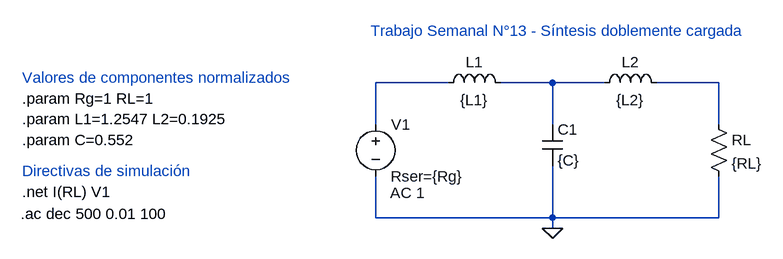
[diagram p0: schematic TS13.asc]
TS13.asc, the LTspice schematic file:
Version 4
SHEET 1 880 680
WIRE 144 144 32 144
WIRE 304 144 224 144
WIRE 384 144 304 144
WIRE 560 144 464 144
WIRE 32 208 32 144
WIRE 304 208 304 144
WIRE 560 208 560 144
WIRE 32 352 32 288
WIRE 304 352 304 272
WIRE 304 352 32 352
WIRE 560 352 560 288
WIRE 560 352 304 352
WIRE 304 368 304 352
FLAG 304 368 0
SYMBOL res 544 192 R0
SYMATTR InstName RL
SYMATTR Value {RL}
SYMBOL cap 288 208 R0
SYMATTR InstName C1
SYMATTR Value {C}
SYMBOL ind 128 160 R270
WINDOW 0 32 56 VTop 2
WINDOW 3 5 56 VBottom 2
SYMATTR InstName L1
SYMATTR Value {L1}
SYMBOL ind 368 160 R270
WINDOW 0 32 56 VTop 2
WINDOW 3 5 56 VBottom 2
SYMATTR InstName L2
SYMATTR Value {L2}
SYMBOL voltage 32 192 R0
WINDOW 123 22 122 Left 2
WINDOW 39 23 96 Left 2
SYMATTR InstName V1
SYMATTR Value ""
SYMATTR Value2 AC 1
SYMATTR SpiceLine Rser={Rg}
TEXT 24 64 Left 2 ;Trabajo Semanal N°13 - Síntesis doblemente cargada
TEXT -512 136 Left 2 ;Valores de componentes normalizados
TEXT -512 168 Left 2 !.param Rg=1 RL=1
TEXT -512 200 Left 2 !.param L1=1.2547 L2=0.1925
TEXT -512 232 Left 2 !.param C=0.552
TEXT -512 280 Left 2 ;Directivas de simulación
TEXT -512 312 Left 2 !.net I(RL) V1
TEXT -514 346 Left 2 !.ac dec 500 0.01 100

The netlist it stands for:
* TS13.asc
RL N003 0 {RL}
C1 N002 0 {C}
L1 N001 N002 {L1}
L2 N002 N003 {L2}
V1 N001 0 AC 1 Rser={Rg}
* Trabajo Semanal N°13 - Síntesis doblemente cargada
* Valores de componentes normalizados
.param Rg=1 RL=1
.param L1=1.2547 L2=0.1925
.param C=0.552
* Directivas de simulación
.net I(RL) V1
.ac dec 500 0.01 100
.backanno
.end